# EAGLE schematic relay-shield (EAGLE 6.6.0)
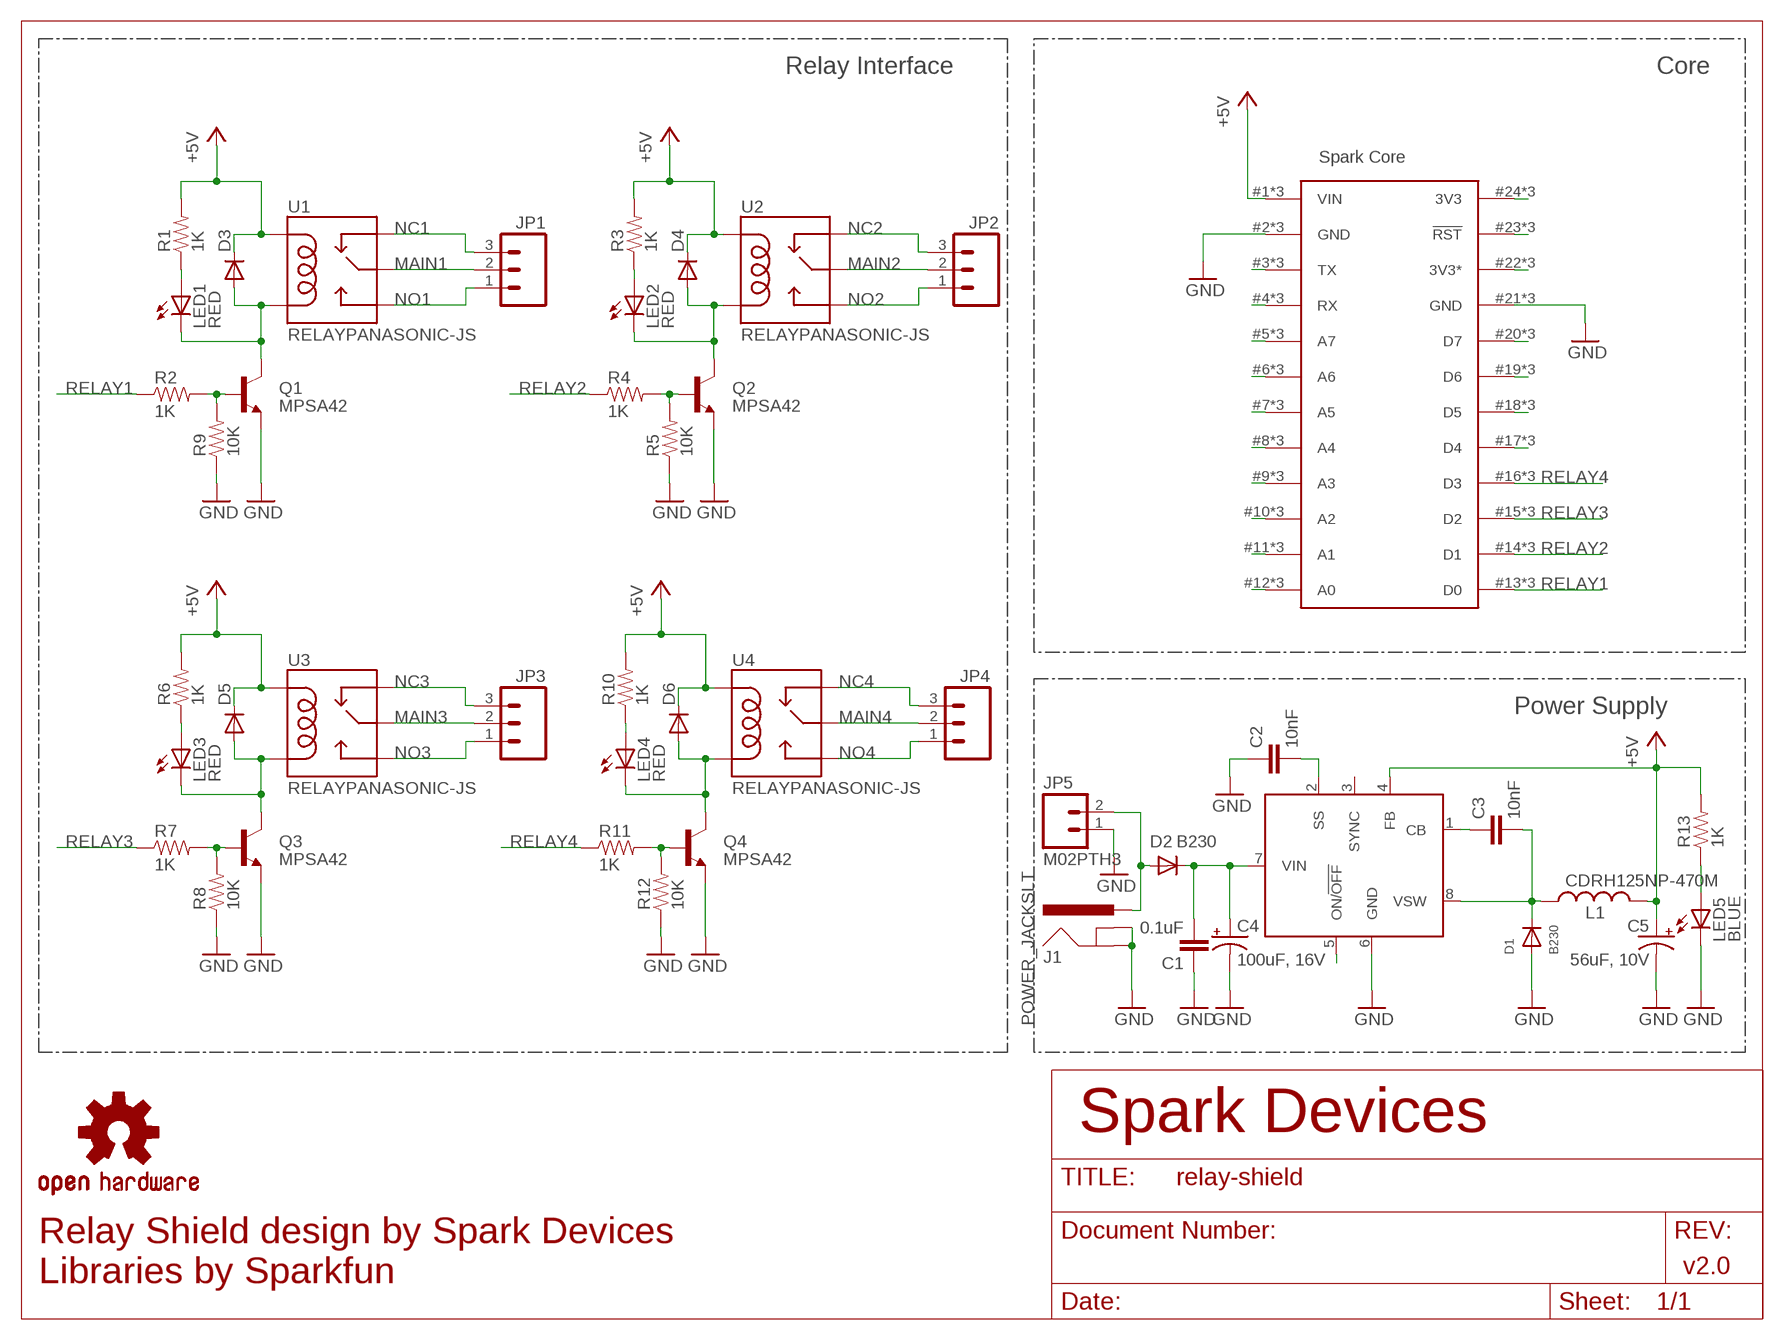
[diagram p0: schematic, sheet 1]

## Parts
C1  0.1uF  0.1UF-25V-5%(0603)  [0603-CAP]
C2  10nF  CAP0603-CAP  [0603-CAP]
C3  10nF  CAP0603-CAP  [0603-CAP]
C4  100uF, 16V  CAP_POLD  [PANASONIC_D]
C5  56uF, 10V  CAP_POLD  [PANASONIC_D]
D1  B230  DIODESMA  [SMADIODE]
D2  B230  DIODESMA  [SMADIODE]
D3  DIODE-SOD123  [SOD123]
D4  DIODE-SOD123  [SOD123]
D5  DIODE-SOD123  [SOD123]
D6  DIODE-SOD123  [SOD123]
J1  POWER_JACKSLT  [POWER_JACK_SLOT]
JP1  M03-SCREW-5MM  [SCREWTERMINAL-5MM-3]
JP2  M03-SCREW-5MM  [SCREWTERMINAL-5MM-3]
JP3  M03-SCREW-5MM  [SCREWTERMINAL-5MM-3]
JP4  M03-SCREW-5MM  [SCREWTERMINAL-5MM-3]
JP5  M02PTH3  [1X02_LONGPADS]
L1  CDRH125NP-470M  INDUCTORPWR  [CDRH125]
LED1  RED  LED0603  [LED-0603]
LED2  RED  LED0603  [LED-0603]
LED3  RED  LED0603  [LED-0603]
LED4  RED  LED0603  [LED-0603]
LED5  BLUE  LED0603  [LED-0603]
LOGO1  OSHW-LOGOM  [OSHW-LOGO-M]
Q1  MPSA42  TRANSISTOR_NPNMPSA42  [SOT23]
Q2  MPSA42  TRANSISTOR_NPNMPSA42  [SOT23]
Q3  MPSA42  TRANSISTOR_NPNMPSA42  [SOT23]
Q4  MPSA42  TRANSISTOR_NPNMPSA42  [SOT23]
R1  1K  RESISTOR0603-RES  [0603-RES]
R2  1K  RESISTOR0603-RES  [0603-RES]
R3  1K  RESISTOR0603-RES  [0603-RES]
R4  1K  RESISTOR0603-RES  [0603-RES]
R5  10K  RESISTOR0603-RES  [0603-RES]
R6  1K  RESISTOR0603-RES  [0603-RES]
R7  1K  RESISTOR0603-RES  [0603-RES]
R8  10K  RESISTOR0603-RES  [0603-RES]
R9  10K  RESISTOR0603-RES  [0603-RES]
R10  1K  RESISTOR0603-RES  [0603-RES]
R11  1K  RESISTOR0603-RES  [0603-RES]
R12  10K  RESISTOR0603-RES  [0603-RES]
R13  1K  RESISTOR0603-RES  [0603-RES]
U1  RELAYPANASONIC-JS  [JS1-5V-F]
U2  RELAYPANASONIC-JS  [JS1-5V-F]
U3  RELAYPANASONIC-JS  [JS1-5V-F]
U4  RELAYPANASONIC-JS  [JS1-5V-F]
U5  LM2672  [SO08]
U$1  SPARK_CORE  [SPARK_CORE_STACKABLE]

## Nets
+5V: C5.+ D3.C D4.C D5.C D6.C L1.2 R1.2 R3.2 R6.2 R10.2 R13.2 U1.COIL1 U2.COIL1 U3.COIL1 U4.COIL1 U5.4(FB) U$1.1(VIN) U$1.#1(VIN) U$1.@1(VIN)
GND: C1.1 C2.1 C4.- C5.- D1.A J1.GND@1(GNDBREAK) J1.GND@2(GND) JP5.1 LED5.C Q1.2(E) Q2.2(E) Q3.2(E) Q4.2(E) R5.1 R8.1 R9.1 R12.1 U5.6(GND) U$1.2(GND) U$1.21(GND) U$1.#2(GND) U$1.#21(GND) U$1.@2(GND) U$1.@21(GND)
MAIN1: JP1.2 U1.COMMON(MAIN)
MAIN2: JP2.2 U2.COMMON(MAIN)
MAIN3: JP3.2 U3.COMMON(MAIN)
MAIN4: JP4.2 U4.COMMON(MAIN)
N$1: D3.A LED1.C Q1.3(C) U1.COIL2
N$2: Q2.1(B) R4.2 R5.2
N$3: Q1.1(B) R2.2 R9.2
N$4: LED1.A R1.1
N$5: D4.A LED2.C Q2.3(C) U2.COIL2
N$6: LED2.A R3.1
N$7: Q3.1(B) R7.2 R8.2
N$8: D5.A LED3.C Q3.3(C) U3.COIL2
N$9: LED3.A R6.1
N$10: Q4.1(B) R11.2 R12.2
N$11: D6.A LED4.C Q4.3(C) U4.COIL2
N$12: LED4.A R10.1
N$13: U$1.17(D4) U$1.#17(D4) U$1.@17(D4)
N$14: C1.2 C4.+ D2.C U5.7(VIN)
N$15: U$1.18(D5) U$1.#18(D5) U$1.@18(D5)
N$16: LED5.A R13.1
N$17: U$1.19(D6) U$1.#19(D6) U$1.@19(D6)
N$18: U$1.20(D7) U$1.#20(D7) U$1.@20(D7)
N$19: U$1.22(3V3*) U$1.#22(3V3*) U$1.@22(3V3*)
N$20: U$1.23(!RST) U$1.#23(!RST) U$1.@23(!RST)
N$21: U$1.24(3V3) U$1.#24(3V3) U$1.@24(3V3)
N$22: U$1.12(A0) U$1.#12(A0) U$1.@12(A0)
N$23: U$1.11(A1) U$1.#11(A1) U$1.@11(A1)
N$24: U$1.10(A2) U$1.#10(A2) U$1.@10(A2)
N$25: U$1.9(A3) U$1.#9(A3) U$1.@9(A3)
N$26: U$1.8(A4) U$1.#8(A4) U$1.@8(A4)
N$27: U$1.7(A5) U$1.#7(A5) U$1.@7(A5)
N$28: U$1.6(A6) U$1.#6(A6) U$1.@6(A6)
N$29: U$1.5(A7) U$1.#5(A7) U$1.@5(A7)
N$30: U$1.4(RX) U$1.#4(RX) U$1.@4(RX)
N$31: U$1.3(TX) U$1.#3(TX) U$1.@3(TX)
N$32: D2.A J1.PWR JP5.2
N$33: C3.1 U5.1(CB)
N$34: C3.2 D1.C L1.1 U5.8(VSW)
N$35: U5.5(ON/!OFF)
N$36: C2.2 U5.2(SS)
NC1: JP1.3 U1.CLOSED(NC)
NC2: JP2.3 U2.CLOSED(NC)
NC3: JP3.3 U3.CLOSED(NC)
NC4: JP4.3 U4.CLOSED(NC)
NO1: JP1.1 U1.OPEN(NO)
NO2: JP2.1 U2.OPEN(NO)
NO3: JP3.1 U3.OPEN(NO)
NO4: JP4.1 U4.OPEN(NO)
RELAY1: R2.1 U$1.13(D0) U$1.#13(D0) U$1.@13(D0)
RELAY2: R4.1 U$1.14(D1) U$1.#14(D1) U$1.@14(D1)
RELAY3: R7.1 U$1.15(D2) U$1.#15(D2) U$1.@15(D2)
RELAY4: R11.1 U$1.16(D3) U$1.#16(D3) U$1.@16(D3)
Unconnected: U5.3(SYNC)

## Notes on the sheet
- Relay Interface | Core
- Spark Core
- Power Supply
- Spark Devices
- v2.0
- Relay Shield design by Spark Devices
  Libraries by Sparkfun

## Library data of the parts
C1 = SparkFun-Capacitors:0.1UF-25V-5%(0603): CAP-08604; PROD_ID: CAP-08604
C2 C3 = SparkFun-Capacitors:CAP: Capacitor Standard 0603 ceramic capacitor, and 0.1" leaded capacitor.
C4 C5 = SparkFun-Capacitors:CAP_POL: Capacitor Polarized These are standard SMD and PTH capacitors. Normally 10uF, 47uF, and 100uF in electrolytic and tantalum varieties. Always verify the external diameter of the through hole cap, it varies with capacity, voltage, and manufacturer. The EIA devices should be standard.
D1 D2 = adafruit:DIODE: Diode SMADIODE - SMA Surface Mount Package 20V 1A Schottky Diode Digikey: 641-1014-6-ND DO-1N4148 - Through Hole Small Current Diode SOD-123 20V 1 A (.5mV Vf) Schottky Diode - Digikey: MBRX120TPMSCT-ND SOD-323 10V 570mA (.38mV Vf, 3ns) Schottky Diode - Digikey: ZLLS410CT-ND SOD-523 30V 30mA Schottky Diode (RB751S-40TE61) - Digikey: RB751S-40TE61CT-ND SOT23-R/W - SOT23 Package (R = Solder Paste/Reflow Ovens, W = Hand-Soldering) BAT54Film 40V 300mA - Digikey: 497-7162-1-ND
D3-D6 = diode:DIODE-: DIODE
J1 = Spark:POWER_JACK: Power Jack This is the standard 5.5mm barrel jack for power. The PTH is the most common, proven, reliable, footprint. The Slot footprint only works if the mill layer is transmitted to the PCB fab house so be warned. Spark Fun Electronics SKU : PRT-00119 SMT: CONN-08106 Mating wall wart : TOL-00298 (and others)
JP1-JP4 = SparkFun-Connectors:M03: Header 3 Standard 3-pin 0.1" header. Use with straight break away headers (SKU : PRT-00116), right angle break away headers (PRT-00553), swiss pins (PRT-00743), machine pins (PRT-00117), and female headers (PRT-00115). Molex polarized connector foot print use with SKU : PRT-08232 with associated crimp pins and housings.
JP5 = SparkFun-Connectors:M02: Standard 2-pin 0.1" header. Use with - straight break away headers ( PRT-00116) - right angle break away headers (PRT-00553) - swiss pins (PRT-00743) - machine pins (PRT-00117) - female headers (PRT-00115) Molex polarized connector foot print use with: PRT-08233 with associated crimp pins and housings. 2.54_SCREWTERM for use with PRT-10571. 3.5mm Screw Terminal footprints for PRT-08084 5mm Screw Terminal footprints for use with PRT-08433
L1 = SparkFun-Passives:INDUCTOR: Inductors Basic Inductor/Choke - 0603 and 1206. Footprints are not proven and vary greatly between part numbers. SRN6045- 33uH, 20% 1.4A SDR0403-560KL - 56uH, 10%, 500mA RMS/740mA peak
LED1-LED5 = SparkFun-LED:LED: LEDs Standard schematic elements and footprints for 5mm, 3mm, 1206, and 0603 sized LEDs. 5mm - Spark Fun Electronics SKU : COM-00529 (and others)
LOGO1 = Spark:OSHW-LOGO: Open Source Hardware Logo This logo indicates the piece of hardware it is found on incorporates a OSHW license and/or adheres to the definition of open source hardware found here: http://freedomdefined.org/OSHW
Q1-Q4 = SparkFun-DiscreteSemi:TRANSISTOR_NPN: Generic NPN BJT MMBT2222A - TRANS-08049 (SOT-23, 1A 40V) MPSA42 - TRANS-09116 (SOT-23, 500mA 300V) MMBT5088LT1G - TRANS-11160 (SOT-23, 50 mA 30V); PROD_ID: TRANS-09116
R1-R13 = SparkFun-Passives:RESISTOR: Resistor Basic schematic elements and footprints for 0603, 1206, and PTH resistors.
U1-U4 = Spark:RELAY: SPDT relay (COM-00101)
U5 = Spark:LM2672
U$1 = Spark:SPARK_CORE